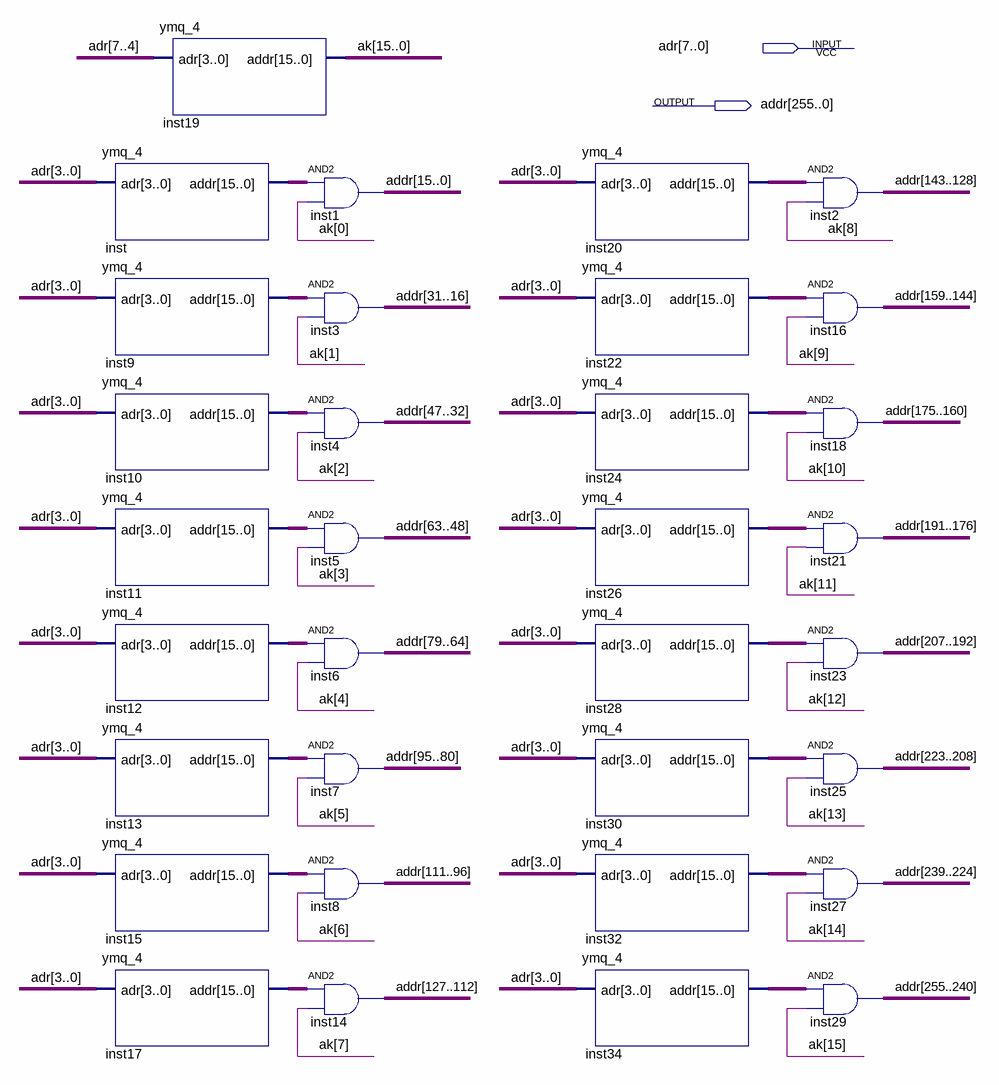
[diagram p0: schematic sheet]
// Quartus schematic ymq8.bdf as structural Verilog: 33 symbols, 2 pins
module ymq8 (
  input  [7:0] adr,
  output [255:0] addr
);

  wire [15:0] ak, inst9_addr, inst10_addr, inst11_addr, inst12_addr, inst13_addr, inst15_addr, inst17_addr,
       inst20_addr, inst22_addr, inst24_addr, inst26_addr, inst28_addr, inst30_addr, inst32_addr,
       inst34_addr, inst_addr;

  ymq_4 inst19 (.adr(adr[7:4]), .addr(ak));
  ymq_4 inst (.adr(adr[3:0]), .addr(inst_addr));
  ymq_4 inst9 (.adr(adr[3:0]), .addr(inst9_addr));
  ymq_4 inst10 (.adr(adr[3:0]), .addr(inst10_addr));
  ymq_4 inst11 (.adr(adr[3:0]), .addr(inst11_addr));
  ymq_4 inst12 (.adr(adr[3:0]), .addr(inst12_addr));
  ymq_4 inst13 (.adr(adr[3:0]), .addr(inst13_addr));
  ymq_4 inst15 (.adr(adr[3:0]), .addr(inst15_addr));
  ymq_4 inst17 (.adr(adr[3:0]), .addr(inst17_addr));
  assign addr[15:0] = inst_addr & {16{ak[0]}};  // AND2 inst1, 16 bits wide
  assign addr[31:16] = inst9_addr & {16{ak[1]}};  // AND2 inst3, 16 bits wide
  assign addr[47:32] = inst10_addr & {16{ak[2]}};  // AND2 inst4, 16 bits wide
  assign addr[63:48] = inst11_addr & {16{ak[3]}};  // AND2 inst5, 16 bits wide
  assign addr[79:64] = inst12_addr & {16{ak[4]}};  // AND2 inst6, 16 bits wide
  assign addr[95:80] = inst13_addr & {16{ak[5]}};  // AND2 inst7, 16 bits wide
  assign addr[111:96] = inst15_addr & {16{ak[6]}};  // AND2 inst8, 16 bits wide
  assign addr[127:112] = inst17_addr & {16{ak[7]}};  // AND2 inst14, 16 bits wide
  ymq_4 inst20 (.adr(adr[3:0]), .addr(inst20_addr));
  ymq_4 inst22 (.adr(adr[3:0]), .addr(inst22_addr));
  ymq_4 inst24 (.adr(adr[3:0]), .addr(inst24_addr));
  ymq_4 inst26 (.adr(adr[3:0]), .addr(inst26_addr));
  ymq_4 inst28 (.adr(adr[3:0]), .addr(inst28_addr));
  ymq_4 inst30 (.adr(adr[3:0]), .addr(inst30_addr));
  ymq_4 inst32 (.adr(adr[3:0]), .addr(inst32_addr));
  ymq_4 inst34 (.adr(adr[3:0]), .addr(inst34_addr));
  assign addr[143:128] = inst20_addr & {16{ak[8]}};  // AND2 inst2, 16 bits wide
  assign addr[159:144] = inst22_addr & {16{ak[9]}};  // AND2 inst16, 16 bits wide
  assign addr[175:160] = inst24_addr & {16{ak[10]}};  // AND2 inst18, 16 bits wide
  assign addr[191:176] = inst26_addr & {16{ak[11]}};  // AND2 inst21, 16 bits wide
  assign addr[207:192] = inst28_addr & {16{ak[12]}};  // AND2 inst23, 16 bits wide
  assign addr[223:208] = inst30_addr & {16{ak[13]}};  // AND2 inst25, 16 bits wide
  assign addr[239:224] = inst32_addr & {16{ak[14]}};  // AND2 inst27, 16 bits wide
  assign addr[255:240] = inst34_addr & {16{ak[15]}};  // AND2 inst29, 16 bits wide
endmodule
